# Altium schematic sheet subckt_DN_RF2,3_filter_bank.SchDoc: DOWN RF2,3 filter bank
size A3; DocumentNumber: 19; Revision: 0; SheetNumber: 19; SheetTotal: 19
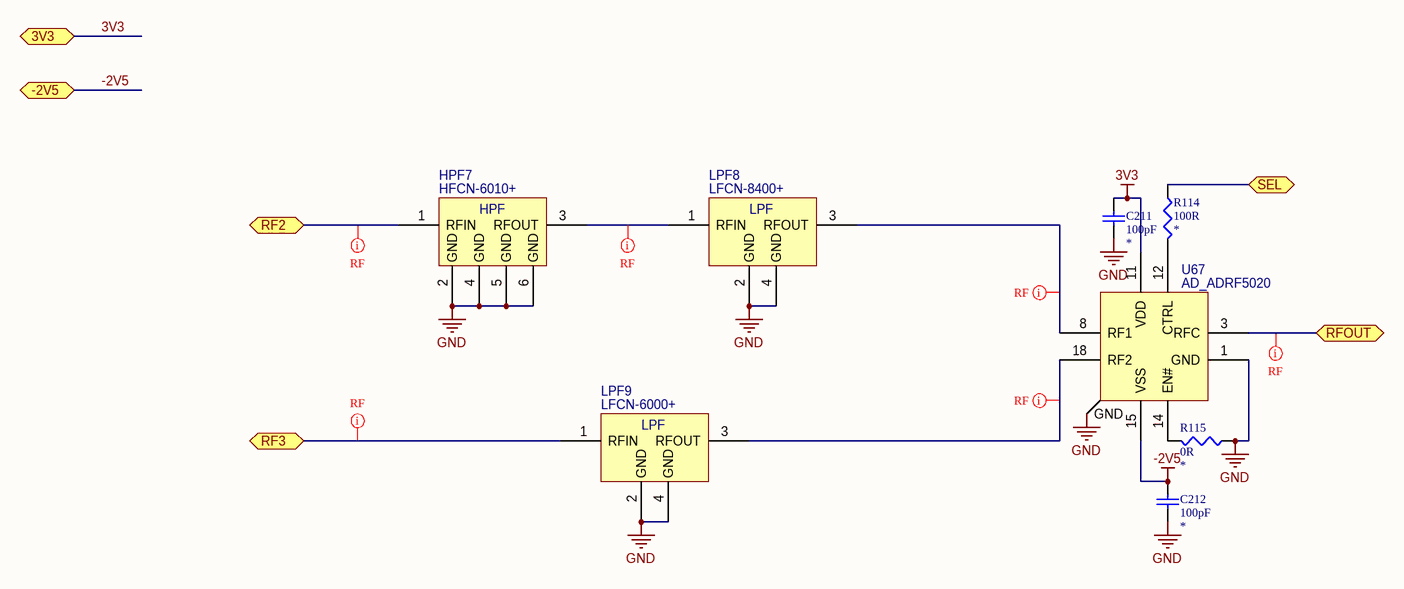
[diagram p0: subckt_DN_RF2,3_filter_bank.SchDoc]

## Parts
C211  value 100pF  [TBD]  (hidden comment: Capacitor)
C212  value 100pF  [TBD]  (hidden comment: Capacitor)
HPF7  HFCN-6010+
LPF8  LFCN-8400+
LPF9  LFCN-6000+
R114  value 100R  [RES0603]  (hidden comment: Resistor)
R115  value 0R  [RES0603]  (hidden comment: Resistor)
U67  AD_ADRF5020

## Ports
3V3, -2V5, RF2, RF3, RFOUT, SEL

## Nets
3V3: C211.2 U67.11(VDD) ; port 3V3
-2V5: C212.2 U67.15(VSS) ; port -2V5
GND: C211.1 C212.1 HPF7.2(GND) HPF7.4(GND) HPF7.5(GND) HPF7.6(GND) LPF8.2(GND) LPF8.4(GND) LPF9.2(GND) LPF9.4(GND) R115.2 U67.1(GND) U67.2(GND) U67.4(GND) U67.5(GND) U67.6(GND) U67.7(GND) U67.9(GND) U67.10(GND) U67.13(GND) U67.16(GND) U67.17(GND) U67.19(GND) U67.20(GND) U67.21(GND)
RF2: HPF7.1(RFIN) ; port RF2
RF3: LPF9.1(RFIN) ; port RF3
RFOUT: U67.3(RFC) ; port RFOUT
SEL: R114.2 ; port SEL
NetHPF7_3: HPF7.3(RFOUT) LPF8.1(RFIN)
NetLPF8_3: LPF8.3(RFOUT) U67.8(RF1)
NetLPF9_3: LPF9.3(RFOUT) U67.18(RF2)
NetR114_1: R114.1 U67.12(CTRL)
NetR115_1: R115.1 U67.14(EN#)

## Layout directives
net class RF: NetHPF7_3, NetLPF8_3, NetLPF9_3, RF2, RF3, RFOUT

## Notes on the sheet
- (in symbol minicircuits_HFCN-6010+) HPF
- (in symbol minicircuits_LFCN-6000+) LPF
- (in symbol minicircuits_LFCN-8400+) LPF

## Library data of the parts
HPF7 = minicircuits_HFCN-6010+: HPF 6.3GHz-15GHz
LPF8 = minicircuits_LFCN-8400+: LPF 8400MHz
LPF9 = minicircuits_LFCN-6000+: LPF 6000MHz
U67 = AD_ADRF5020: AD SPDT Switch, 100MHz-30GHz
C211 C212 = Capacitor: Dielectric: *
R114 R115 = Resistor: Type: *